# EAGLE design icu_board (EAGLE 9.3.0)
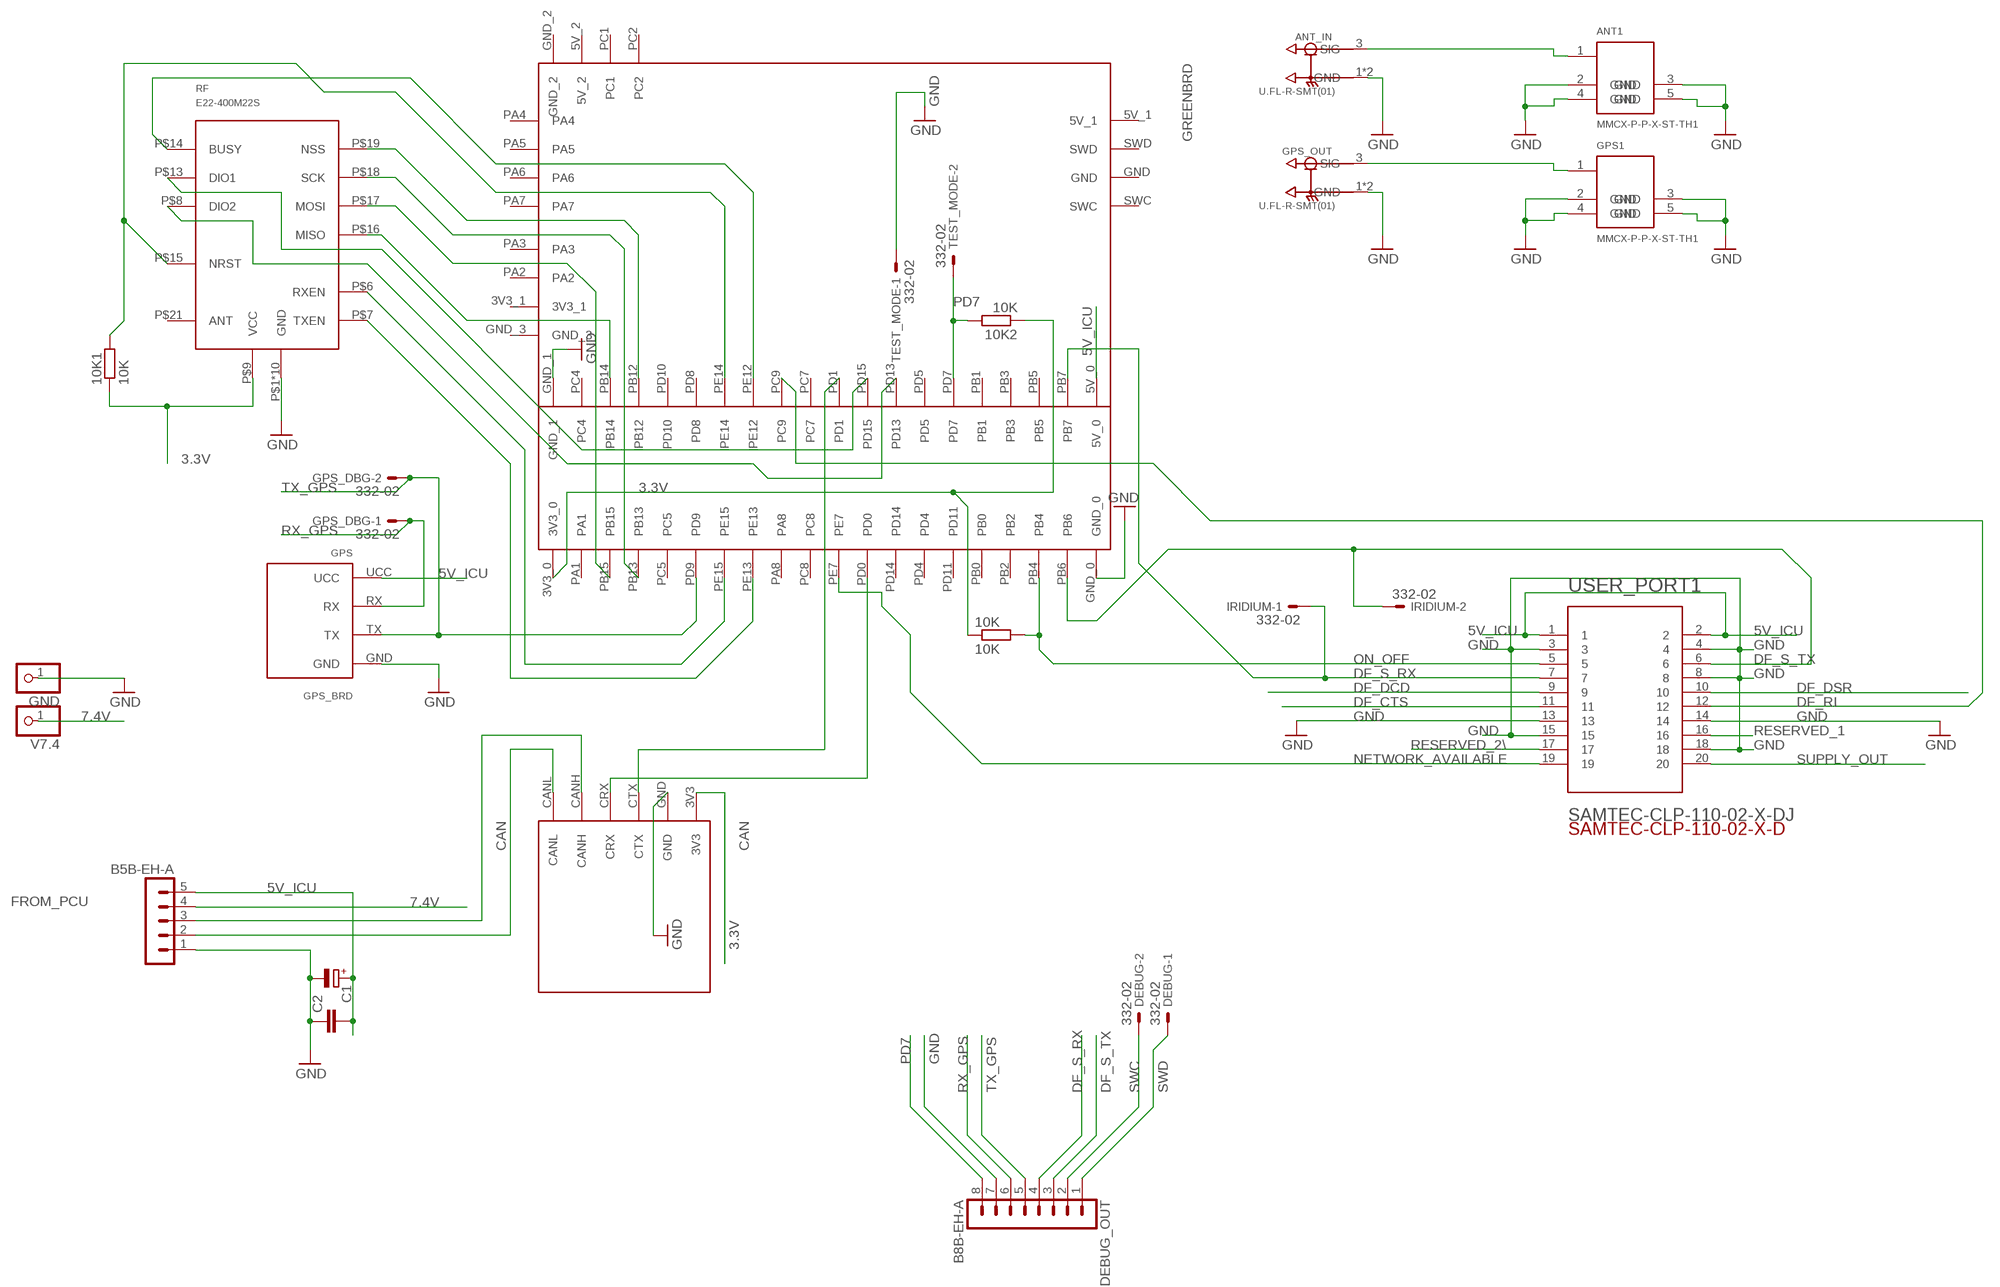
[diagram p0: schematic, sheet 1]

## Parts
10K  10K  R-EU_0204/7  [0204/7]
10K1  10K  R-EU_0204/7  [0204/7]
10K2  10K  R-EU_0204/7  [0204/7]
ANT1  MMCX-P-P-X-ST-TH1  [MMCX-P-P-X-ST-TH1]
ANT_IN  U.FL-R-SMT(01)  [HRS_U.FL-R-SMT(01)]
C1  CPOL-EUE3.5-8  [E3,5-8]
C2  C2.5/2  [C2.5-2]
CAN  CAN  [CAN]
DEBUG  332-02  [332-02]
DEBUG_OUT  B8B-EH-A  [B8B-EH-A]
FROM_PCU  B5B-EH-A  [B5B-EH-A]
GND  PINHD-1X1  [1X01]
GPS1  MMCX-P-P-X-ST-TH1  [MMCX-P-P-X-ST-TH1]
GPS_BRD  GPS  [GPS]
GPS_DBG  332-02  [332-02]
GPS_OUT  U.FL-R-SMT(01)  [HRS_U.FL-R-SMT(01)]
GREENBRD  ICU  [ICU]
IRIDIUM  332-02  [332-02]
RF  E22-400M22S  [E22-400M22S]
TEST_MODE  332-02  [332-02]
USER_PORT1  SAMTEC-CLP-110-02-X-DJ  [SAMTEC-CLP-110-02-X-D]
V7.4  PINHD-1X1  [1X01]

## Nets
3.3V: 10K1.1 10K2.1 10K.1 CAN.3V3 GREENBRD.3V3_0 RF.P$9(VCC)
5V_ICU: C1.+ C2.2 FROM_PCU.5 GPS_BRD.UCC GREENBRD.5V_0 USER_PORT1.1 USER_PORT1.2
7.4V: FROM_PCU.4 V7.4.1
DF_CTS: USER_PORT1.11
DF_DCD: USER_PORT1.9
DF_DSR: USER_PORT1.10
DF_RI: GREENBRD.PC9 USER_PORT1.12
DF_S_RX: DEBUG_OUT.4 GREENBRD.PB7 IRIDIUM.1 USER_PORT1.7
DF_S_TX: DEBUG_OUT.3 GREENBRD.PB6 IRIDIUM.2 USER_PORT1.6
GND: ANT1.2(GND) ANT1.3(GND) ANT1.4(GND) ANT1.5(GND) ANT_IN.1(GND) ANT_IN.2(GND) C1.- C2.1 CAN.GND DEBUG_OUT.7 FROM_PCU.1 GND.1 GPS1.2(GND) GPS1.3(GND) GPS1.4(GND) GPS1.5(GND) GPS_BRD.GND GPS_OUT.1(GND) GPS_OUT.2(GND) GREENBRD.GND_0 GREENBRD.GND_1 RF.P$1(GND) RF.P$2(GND) RF.P$3(GND) RF.P$4(GND) RF.P$5(GND) RF.P$10(GND) RF.P$11(GND) RF.P$12(GND) RF.P$20(GND) RF.P$22(GND) TEST_MODE.1 USER_PORT1.3 USER_PORT1.4 USER_PORT1.8 USER_PORT1.13 USER_PORT1.14 USER_PORT1.15 USER_PORT1.18
N$1: CAN.CANH FROM_PCU.3
N$2: GREENBRD.PB12 RF.P$19(NSS)
N$3: CAN.CANL FROM_PCU.2
N$4 [rf]: ANT1.1 ANT_IN.3(SIG)
N$5 [rf]: GPS1.1 GPS_OUT.3(SIG)
N$6: GREENBRD.PE15 RF.P$6(RXEN)
N$8: GREENBRD.PB13 RF.P$18(SCK)
N$9: CAN.CRX GREENBRD.PD0
N$10: CAN.CTX GREENBRD.PD1
N$12: GREENBRD.PD15 RF.P$13(DIO1)
N$13: GREENBRD.PD13 RF.P$8(DIO2)
N$15: GREENBRD.PB15 RF.P$17(MOSI)
N$16: GREENBRD.PB14 RF.P$16(MISO)
N$17: GREENBRD.PE12 RF.P$14(BUSY)
N$18: 10K1.2 GREENBRD.PE14 RF.P$15(NRST)
N$22: GREENBRD.PE13 RF.P$7(TXEN)
NETWORK_AVAILABLE: GREENBRD.PE7 USER_PORT1.19
ON_OFF: 10K.2 GREENBRD.PB4 USER_PORT1.5
PD7: 10K2.2 DEBUG_OUT.8 GREENBRD.PD7 TEST_MODE.2
RESERVED_1: USER_PORT1.16
RESERVED_2\: USER_PORT1.17
RX_GPS: DEBUG_OUT.6 GPS_BRD.RX GPS_DBG.1
SUPPLY_OUT: USER_PORT1.20
SWC: DEBUG.2 DEBUG_OUT.2
SWD: DEBUG.1 DEBUG_OUT.1
TX_GPS: DEBUG_OUT.5 GPS_BRD.TX GPS_DBG.2 GREENBRD.PD9
Unconnected: GREENBRD.3V3_1 GREENBRD.5V_1 GREENBRD.5V_2 GREENBRD.GND GREENBRD.GND_2 GREENBRD.GND_3 GREENBRD.PA1 GREENBRD.PA2 GREENBRD.PA3 GREENBRD.PA4 GREENBRD.PA5 GREENBRD.PA6 GREENBRD.PA7 GREENBRD.PA8 GREENBRD.PB0 GREENBRD.PB1 GREENBRD.PB2 GREENBRD.PB3 GREENBRD.PB5 GREENBRD.PC1 GREENBRD.PC2 GREENBRD.PC4 GREENBRD.PC5 GREENBRD.PC7 GREENBRD.PC8 GREENBRD.PD4 GREENBRD.PD5 GREENBRD.PD8 GREENBRD.PD10 GREENBRD.PD11 GREENBRD.PD14 GREENBRD.SWC GREENBRD.SWD RF.P$21(ANT)

## Library data of the parts
10K 10K1 10K2 = rcl:R-EU_: RESISTOR, European symbol; SPICEPREFIX: R
ANT1 GPS1 = MMCX-P-P-X-ST-TH1:MMCX-P-P-X-ST-TH1: MMCX STRAIGHT,THROUGH HOLE PLUG - 50 OHM.; DESCRIPTION: Conn MMCX PL 0Hz to 6GHz 50Ohm Solder ST Thru-Hole Gold Over Nickel; DIGI-KEY_PART_NUMBER: SAM10618-ND; DIGI-KEY_PURCHASE_URL: https://www.digikey.ru/product-detail/en/samtec-inc/MMCX-P-P-H-ST-TH1/SAM10618-ND/6561612?utm_source=snapeda&utm_medium=aggregator&utm_campaign=symbol; MF: Samtec Inc.; MP: MMCX-P-P-H-ST-TH1; PACKAGE: None
ANT_IN GPS_OUT = U.FL-R-SMT_01_:U.FL-R-SMT(01): U.FL Series 6 Ghz 50 Ohm Ultra-small SMT Coaxial Cable Receptacle; DESCRIPTION: U.FL Series 6 Ghz 50 Ohm Ultra-small SMT Coaxial Cable Receptacle; DIGI-KEY_PART_NUMBER: H9161-ND; DIGI-KEY_PURCHASE_URL: https://www.digikey.ru/product-detail/en/hirose-electric-co-ltd/U.FL-R-SMT_01_/H9161-ND/513010?utm_source=snapeda&utm_medium=aggregator&utm_campaign=symbol; MF: Hirose; MP: U.FL-R-SMT_01_; PACKAGE: None
C1 = rcl:CPOL-EU: POLARIZED CAPACITOR, European symbol; SPICEPREFIX: C
C2 = capacitor-wima:C: CAPACITOR naming: grid - package width
CAN = bluepill:CAN
DEBUG GPS_DBG IRIDIUM TEST_MODE = con-garry:332-02: 2 Pin - 2mm Dual Row Source: www.mpe-connector.de / garry_shortform_2012.pdf
DEBUG_OUT = con-jst-eh:B8B-EH-A: HEADER
FROM_PCU = con-jst-eh:B5B-EH-A: HEADER
GND V7.4 = pinhead:PINHD-1X1: PIN HEADER
GPS_BRD = bluepill:GPS
GREENBRD = bluepill:ICU
RF = ebyte-radio:E22-400M22S: EBYTE E22400M22S radio module Datasheet and info: http://www.ebyte.com/en/product-view-news.aspx?id=436
USER_PORT1 = SAMTEC-CLP-110-02-X-D:SAMTEC-CLP-110-02-X-D; DESCRIPTION: .050 Tiger Claw™ Rugged Reliable Dual Wipe Socket Strip; DIGI-KEY_PART_NUMBER: CLP-110-02-L-D-K-ND; DIGI-KEY_PURCHASE_URL: https://www.digikey.ru/product-detail/en/samtec-inc/CLP-110-02-L-D-K/CLP-110-02-L-D-K-ND/6693709?utm_source=snapeda&utm_medium=aggregator&utm_campaign=symbol; MF: Samtec Inc.; MP: CLP-110-02-L-D-K; PACKAGE: None

## Net classes
0 default: width 0.2 mm, clearance 0.2 mm
1 power: width 0.5 mm, clearance 0.2 mm
2 rf: width 0.5 mm, clearance 0.065 mm

## Board
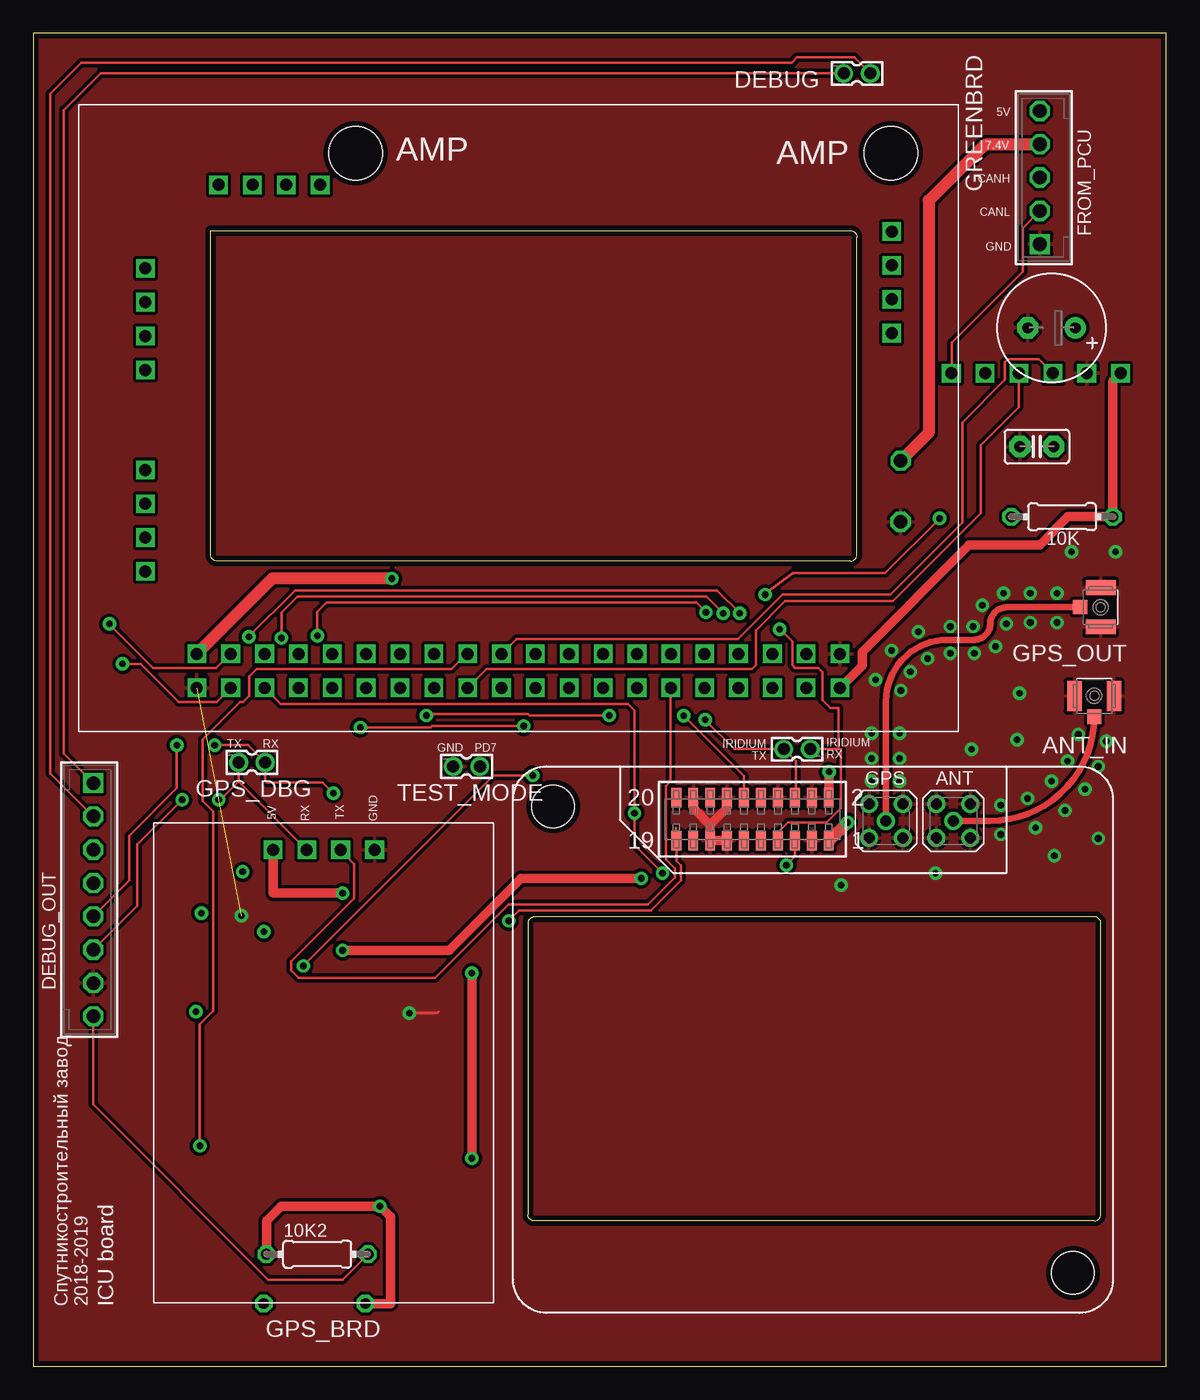
[diagram p1: board, top side]
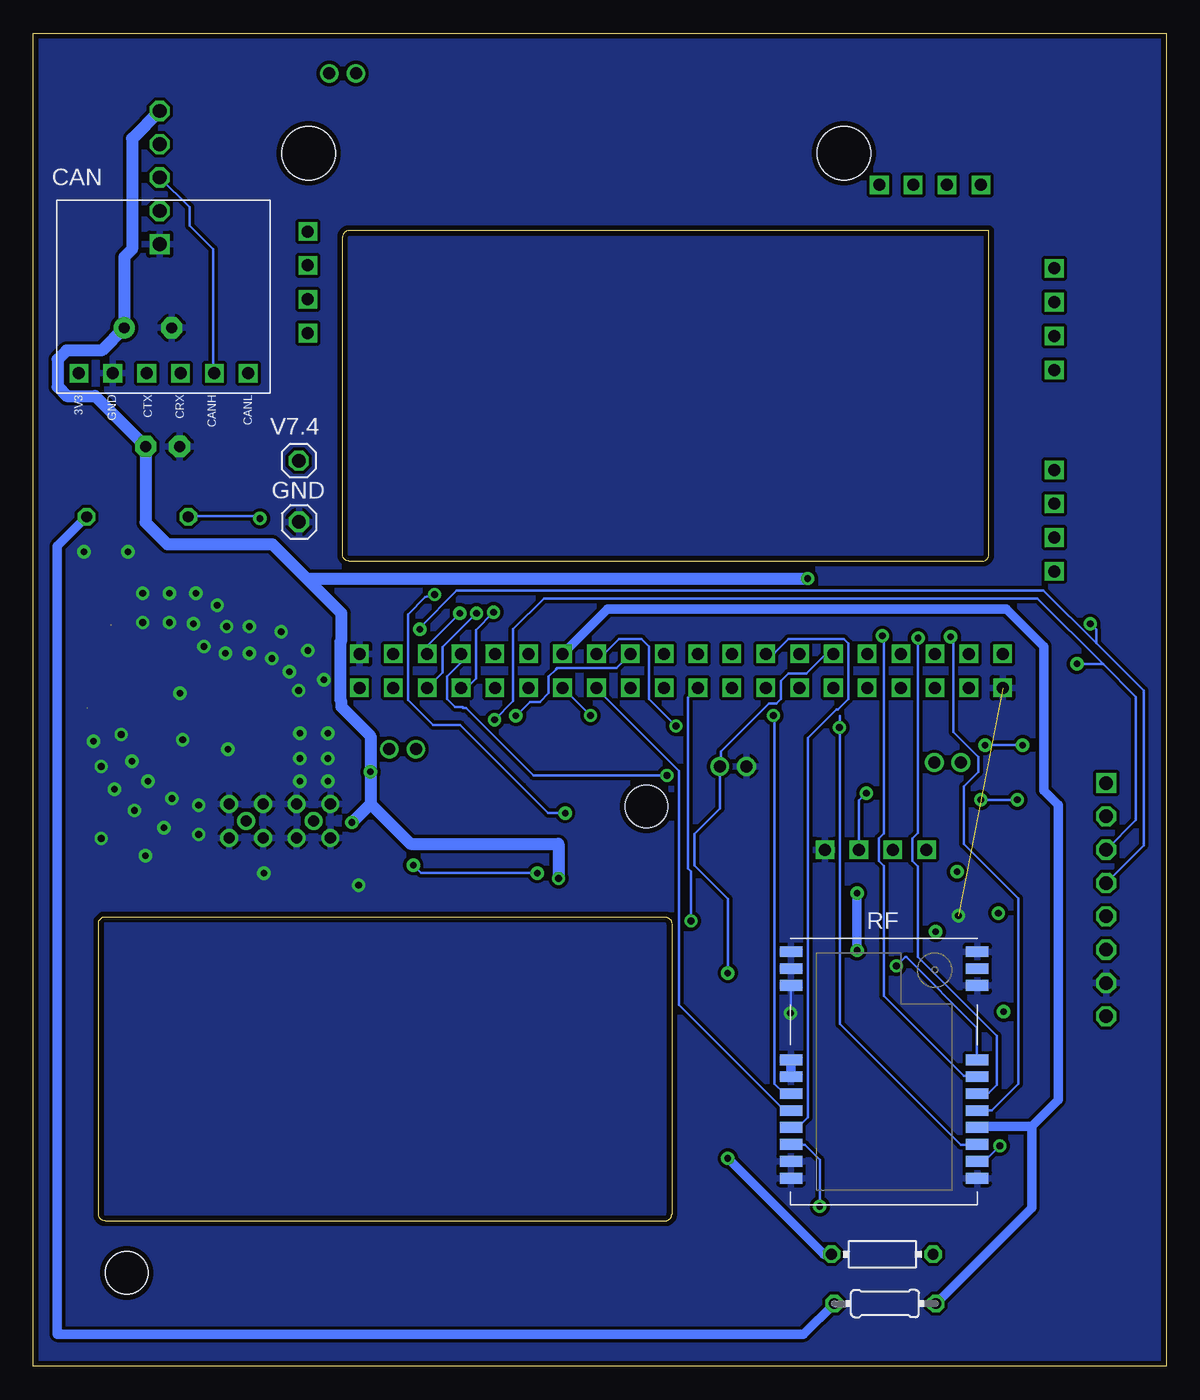
[diagram p2: board, bottom side, seen from below]

Size 85 x 100 mm. Coordinates in mm from the lower left corner, seen from the top.
Outline: 0,0 85,0 85,100 0,100 0,0
Outline: 13.3,85.2 61.3,85.2 arc-90 61.8,84.7 61.8,60.9 arc-90 61.3,60.4 13.8,60.4 arc-90 13.3,60.9 13.3,85.2
Outline: 37.1,33.2 37.1,11.4 arc90 37.6,10.9 79.6,10.9 arc90 80.1,11.4 80.1,33.4 79.8,33.7 37.6,33.7 arc90 37.1,33.2
Copper layers (1*16): Top 0.035mm / dielectric 1mm / Bottom 0.035mm
Design rules "rezonit": minimum track width 0.2mm, minimum drill 0.5mm, track to track 0.25mm, track to pad 0.25mm, pad to pad 0.25mm, via to via 0.25mm, smd to smd 0.2mm, copper to edge 0.4mm, drill to drill 0.4mm, minimum pad ring 0.25mm, minimum via ring 0.25mm, stop-mask expansion 4mil, vias tented up to drill 0.6mm, thermal gap 10mil
Holes 3.2 mm at 39,42 78,7
Holes 4 mm at 24.18,91.01 64.34,91.01

### Footprints (pad centres in the part's own frame; a part is rotated, then mirrored left to right if it is on the bottom)
0204/7 = drill 0.813 octagon: 1 -3.81,0; 2 3.81,0
MMCX-P-P-X-ST-TH1 = drill 0.84 pad 1.3: 1 0,0; 2 -1.27,1.27; 3 -1.27,-1.27; 4 1.27,1.27; 5 1.27,-1.27
HRS_U.FL-R-SMT(01) = smd 1.1 x 2.25: 1 -1.475,0; 2 1.475,0 | smd 1.05 x 1.1: 3 0,-1.55
E3,5-8 = drill 0.813 pad 1.6: + -1.778,0 | drill 0.813 pad 1.6 octagon: - 1.778,0
C2.5-2 = drill 0.813 pad 1.6 octagon: 1 -1.27,0; 2 1.27,0
CAN = drill 0.9 square: 3V3 -5.75,6.35; CANH -5.75,-3.81; CANL -5.75,-6.35; CRX -5.75,-1.27; CTX -5.75,1.27; GND -5.75,3.81
332-02 = drill 0.9 pad 1.27: 1 0,-1; 2 0,1
B8B-EH-A = drill 1.016 square: 1 -8.75,0 | drill 1.016 octagon: 2 -6.25,0; 3 -3.75,0; 4 -1.25,0; 5 1.25,0; 6 3.75,0; 7 6.25,0; 8 8.75,0
B5B-EH-A = drill 1.016 square: 1 -5,0 | drill 1.016 octagon: 2 -2.5,0; 3 0,0; 4 2.5,0; 5 5,0
1X01 = drill 1.016 octagon: 1 0,0
GPS = drill 0.9 square: GND -16,3.81; RX -16,-1.27; TX -16,1.27; UCC -16,-3.81
ICU = drill 0.9 square: 3V3_0 20.23,24.13; 3V3_1 8.96,-28; 5V_0 17.69,-24.13; 5V_1 -14,28; 5V_2 -17.5,-19.96; GND -8.92,28; GND_0 20.23,-24.13; GND_1 17.69,24.13; GND_2 -17.5,-22.5; GND_3 11.5,-28; PA1 20.23,21.59; PA2 6.42,-28; PA3 3.88,-28; PA4 -11.24,-28; PA5 -8.7,-28; PA6 -6.16,-28; PA7 -3.62,-28; PA8 20.23,3.81; PB0 20.23,-13.97; PB1 17.69,-13.97; PB2 20.23,-16.51; PB3 17.69,-16.51; PB4 20.23,-19.05; PB5 17.69,-19.05; PB6 20.23,-21.59; PB7 17.69,-21.59; PB12 17.69,16.51; PB13 20.23,16.51; PB14 17.69,19.05; PB15 20.23,19.05; PC1 -17.5,-17.42; PC2 -17.5,-14.88; PC4 17.69,21.59; PC5 20.23,13.97; PC7 17.69,1.27; PC8 20.23,1.27; PC9 17.69,3.81; PD0 20.23,-3.81; PD1 17.69,-1.27; PD4 20.23,-8.89; PD5 17.69,-8.89; PD7 17.69,-11.43; PD8 17.69,11.43; PD9 20.23,11.43; PD10 17.69,13.97; PD11 20.23,-11.43; PD13 17.69,-6.35; PD14 20.23,-6.35; PD15 17.69,-3.81; PE7 20.23,-1.27; PE12 17.69,6.35; PE13 20.23,6.35; PE14 17.69,8.89; PE15 20.23,8.89; SWC -6.38,28; SWD -11.46,28
E22-400M22S = smd 0.813 x 1.676: P$1 -9,-6.97; P$2 -7.73,-6.97; P$3 -6.46,-6.97; P$4 -0.89,-6.97; P$5 0.38,-6.97; P$6 1.65,-6.97; P$7 2.92,-6.97; P$8 4.19,-6.97; P$9 5.46,-6.97; P$10 6.73,-6.97; P$11 8,-6.97; P$12 8,7; P$13 6.73,7; P$14 5.46,7; P$15 4.19,7; P$16 2.92,7; P$17 1.65,7; P$18 0.38,7; P$19 -0.89,7; P$20 -6.46,7; P$21 -7.73,7; P$22 -9,7
SAMTEC-CLP-110-02-X-D = smd 0.74 x 1.47: 1 -5.715,1.613; 2 -5.715,-1.613; 3 -4.445,1.613; 4 -4.445,-1.613; 5 -3.175,1.613; 6 -3.175,-1.613; 7 -1.905,1.613; 8 -1.905,-1.613; 9 -0.635,1.613; 10 -0.635,-1.613; 11 0.635,1.613; 12 0.635,-1.613; 13 1.905,1.613; 14 1.905,-1.613; 15 3.175,1.613; 16 3.175,-1.613; 17 4.445,1.613; 18 4.445,-1.613; 19 5.715,1.613; 20 5.715,-1.613

### Placement (x,y rotation side)
10K  77.19,63.73 180 top
10K1  21.1,4.7 0 bottom
10K2  21.3,8.4 0 top
ANT1  69.03,40.91 0 top
ANT_IN  79.6,50.28 0 top
C1  76.4,77.9 180 top
C2  75.3,69 0 top
CAN  75.23,80.25 90 bottom
DEBUG  61.8,97 270 top
DEBUG_OUT  4.5,35 270 top
FROM_PCU  75.52,89.18 90 top
GND  65.07,63.34 0 bottom
GPS1  63.98,40.91 0 top
GPS_BRD  21.79,22.75 270 top
GPS_DBG  16.4,45.3 270 top
GPS_OUT  80.08,56.94 270 top
GREENBRD  36.4,71.13 270 top
IRIDIUM  57.3,46.3 90 top
RF  21.18,22.1 270 bottom
TEST_MODE  32.5,45 270 top
USER_PORT1  53.96,41.05 180 top
V7.4  65.09,67.94 0 bottom

### Tracks (layer width: path | path; a pad name or v marks a point on that pad's centre or on a via)
3.3V  (via drill 0.5)
  Top 0.7: 10K1.1 26.8,4.7 26.8,11.2 v26,12 18.6,12 17.49,10.89 10K2.1 | CAN.3V3 81,73.92 10K.1 77.63,63.73 75.5,61.6 70.2,61.6 62.2,53.6 62.2,52.57 GREENBRD.3V3_0
  Bottom 0.2: v26,12 26,15.5 27.1,16.6 28.1,16.6 RF.P$9
  Bottom 0.7: 10K.1 83.2,61.53 83.2,2.4 27.21,2.4 10K1.1
5V_ICU  (via drill 0.5)
  Top 0.2: 59.7,42.7 USER_PORT1.2 | 18,38.7 GPS_BRD.UCC
  Top 0.7: v59.7,44.6 59.7,42.7 | v23.2,35.5 18,35.5 18,38.7 | v45.6,36.6 36.6,36.6 31.2,31.2 v23.2,31.2 | 61,40.7 v61.1,40.8 | 59.74,39.44 USER_PORT1.1
  Top 0.9: v61.1,40.8 59.74,39.44 | v26.9,59.1 17.93,59.1 GREENBRD.5V_0
  Bottom 0.7: v23.2,31.2 v23.2,35.5
  Bottom 0.9: FROM_PCU.5 77.6,92.1 77.6,83.8 78.18,83.22 C1.+ 79.87,76.2 82.5,76.2 83.18,75.52 83.18,73.48 82.5,72.8 80.37,72.8 C2.2 76.57,63.3 74.95,61.68 67.08,61.68 64.5,59.1 | v45.6,36.6 45.6,39.2 56.7,39.2 59.7,42.2 | 59.7,42.2 v59.7,44.6 59.7,47.28 61.88,49.46 61.88,49.86 61.93,49.91 61.93,54.43 61.88,54.48 61.88,56.48 64.5,59.1 | 59.7,42.2 v61.1,40.8 | 64.5,59.1 v26.9,59.1
7.4V
  Top 0.9: V7.4.1 67.18,70.03 67.18,87.45 67.21,87.45 71.3,91.53 arc-45 71.65,91.68 FROM_PCU.4
DF_RI  (via drill 0.5)
  Top 0.2: USER_PORT1.12 53.3,42.7 53.3,44.3 v48.8,48.8
  Bottom 0.2: v48.8,48.8 47.75,49.85 46.98,49.85 46.34,50.49 46.34,51.74 45.8,52.28 | 45.8,52.28 45.8,52.3 | 45.8,52.28 45.7,52.39 41.26,52.39 GREENBRD.PC9
DF_S_RX  (via drill 0.5)
  Top 0.2: 60.4,46.3 60.4,49.4 59.8,49.4 59.2,50 59.2,52.1 58.91,52.39 57.15,52.39 56.94,52.59 56.94,54.36 v56,55.3 | USER_PORT1.7 55.9,39.5 55.9,40.1 56.6,40.8 59.5,40.8 60.6,41.9 60.6,46.3 60.4,46.3 | IRIDIUM.1 60.4,46.3 | v5.7,55.7 9.01,52.39 13.12,52.39 13.12,52.4 13.7,52.4 14.74,53.44 GREENBRD.PB7
  Bottom 0.2: 5.25,54.25 9.21,58.2 53.23,58.2 56,55.43 v56,55.3 | 5.25,54.25 1.68,50.68 1.68,39.07 DEBUG_OUT.4 | 5.25,54.25 5.25,55.25 v5.7,55.7
DF_S_TX  (via drill 0.5)
  Top 0.2: USER_PORT1.6 57.2,42.7 57.2,45.4 IRIDIUM.2 52.6,46.3 v50.4,48.5 | v6.7,52.7 8.06,52.7 10.91,49.85 13.76,49.85 GREENBRD.PB6
  Bottom 0.2: v50.4,48.5 49,49.9 49,55.3 46.7,57.6 9.67,57.6 4.74,52.66 | 4.74,52.66 2.28,50.21 2.28,40.97 DEBUG_OUT.3 | 4.74,52.66 6.67,52.66 v6.7,52.7
GND  (via drill 0.5)  (1 unrouted)
  Top 0.2: USER_PORT1.15 | v28.2,26.5 30.3,26.5 30.4,26.6
  Top 0.7: USER_PORT1.15 USER_PORT1.13 | USER_PORT1.18 49.52,41.88 50.78,40.62 | 50.78,40.62 USER_PORT1.15 | USER_PORT1.14 52.05,41.89 50.78,40.62
  Bottom 0.2: RF.P$3 28.15,26.55 v28.2,26.5
  Bottom 0.7: RF.P$4 RF.P$5
  other vias: 67.1,53.1 74.8,58 74.8,55.8 70.5,55.5 70.6,53.5 71.2,57.1 68.8,53.5 64.4,53.7 66.4,55.1 65.1,50.7 63.2,51.5 65.8,52.1 68.8,55.5 72.2,54 80.5,46.9 78.4,47.4 76.8,55.8 72.8,58 73,55.7 76.8,58 81.2,61.1 15.6,33.8 62.9,47.5 65,47.5 65,45.6 62.9,45.6 62.9,43.9 65,43.9 79.9,45 77.6,45.4 78.9,43.3 76.4,43.9 77.4,41.7 74.6,42.6 72.6,42.1 72.6,39.9 75.2,40.4 74,50.5 70.4,46.3 73.8,47 77.9,61.1 67.7,37 76.6,38.3 79.9,39.6 60.6,36.1
  pour Top: 0,100 85,100 85,0 0,0
  pour Bottom: 0,100 85,100 85,0 0,0
N$1
  Bottom 0.2: CAN.CANH 71.5,74.5 71.5,83.8 73.29,85.59 73.29,86.95 FROM_PCU.3
N$2  (via drill 0.5)
  Top 0.2: v37.46,44.33 34.54,44.33 v20.25,30.04
  Bottom 0.2: RF.P$19 14.2,23 14.2,25.4 19.5,30.7 19.57,30.71 v20.25,30.04 | GREENBRD.PB12 52.91,52.8 53.96,51.74 53.96,50.05 53.35,49.45 52.8,49.45 52.76,49.39 52.54,49.39 47.48,44.33 v37.46,44.33
N$3
  Top 0.2: CAN.CANL 68.9,74.5 68.9,76.8 74.23,82.13 74.23,85.39 FROM_PCU.2
N$4
  Top 0.5: ANT1.1 71.78,40.91 arc90 ANT_IN.3
N$5
  Top 0.5: GPS1.1 63.98,49.88 arc-90 68.6,54.5 70.6,54.5 arc90 71.8,55.7 arc-90 73.04,56.94 GPS_OUT.3
N$6  (via drill 0.5)
  Top 0.2: v43.2,48.83 37.24,48.83 37.12,48.94 29.59,48.94 v29.48,48.83
  Bottom 0.2: 29.4,49.1 29.4,48.83 | 29.4,48.83 29.4,21.2 28.7,20.5 28.2,20.5 RF.P$6 | v43.2,48.83 45.23,50.85 GREENBRD.PE15 | v29.48,48.83 29.4,48.83
N$8  (via drill 0.5)
  Top 0.2: v21.3,54.8 21.3,56.6 22,57.3 49.75,57.3 v50.47,56.57
  Bottom 0.2: RF.P$18 14.2,21.8 15.2,21.8 21.2,27.8 21.2,37.53 21.57,37.91 21.57,39.59 21.2,39.97 21.2,54.7 v21.3,54.8 | v50.47,56.57 51.8,55.25 51.8,51.6 52.5,50.9 GREENBRD.PB13
N$9
  Top 0.2: GREENBRD.PD0 33.99,52.3 53.9,52.3 54.2,52.6 54.2,55.2 56.4,57.4 64.5,57.4 71.1,64 71.1,69.1 73.96,71.96 CAN.CRX
N$10
  Top 0.2: GREENBRD.PD1 36.26,54.57 52.87,54.57 56.2,57.9 64.3,57.9 69.7,63.3 69.7,70.8 72.91,74.01 72.91,75.34 73.11,75.55 75.45,75.55 CAN.CTX
N$12  (via drill 0.5)
  Top 0.2: v12.49,16.54 12.49,25.65 13.5,26.66 13.5,41.62 12.71,42.41 12.71,47.02 15.53,49.84 15.75,49.84 16.2,50.29 16.2,51.75 16.76,52.31 31.39,52.31 32.51,53.44 GREENBRD.PD15
  Bottom 0.2: 14.21,15.4 RF.P$13 14.18,15.41 13.61,15.41 v12.49,16.54
N$13
  Bottom 0.2: 28.2,18 RF.P$8 28.12,18 27.56,18 26.89,18.68 26.89,47.14 24.75,49.27 24.64,49.27 23.85,50.06 23.85,54.23 24.19,54.56 28.35,54.56 29.36,53.55 30.04,53.55 GREENBRD.PD13
N$14  (via drill 0.5)
  other vias: 17.3,32.6
N$15  (via drill 0.5)
  Top 0.2: v18.62,54.63 18.62,56.53 19.84,57.75 50.5,57.75 v51.75,56.5
  Bottom 0.2: RF.P$17 14.1,20.5 13.3,20.5 12.7,21.1 12.7,24.8 18.62,30.72 18.62,37.49 19.03,37.91 19.03,39.59 18.62,40.01 v18.62,54.63 | v51.75,56.5 54.3,53.95 54.3,52.05 GREENBRD.PB15
N$16  (via drill 0.5)
  Top 0.2: v16.18,54.73 19.65,58.2 51.3,58.2 v53,56.5
  Bottom 0.2: RF.P$16 14.1,19.2 13.1,19.2 11.1,21.2 11.1,35.1 15.2,39.2 15.2,43.48 14.1,44.58 14.1,45.72 15.96,47.58 15.96,54.52 v16.18,54.73 | v53,56.5 55.45,54.05 GREENBRD.PB14
N$17  (via drill 0.5)
  Top 0.2: v36.79,48.04 29.93,48.04 29.81,47.92 v24.52,47.92
  Bottom 0.2: RF.P$14 14.22,16.6 15.4,16.6 24.5,25.7 24.5,47.92 | 24.5,48.8 24.5,47.92 | v36.79,48.04 38.81,50.06 38.81,54 39.38,54.56 41.06,54.56 42.08,53.55 42.75,53.55 GREENBRD.PE12 | v24.52,47.92 24.5,47.92
N$18
  Bottom 0.2: RF.P$15
  Bottom 0.7: RF.P$15 14.08,18 10.1,18 | 10.1,18 8.1,20 8.1,42.1 9.2,43.2 9.2,54 12,56.8 41.93,56.8 GREENBRD.PE14 | 10.1,18 10.1,11.89 10K1.2
N$19  (via drill 0.5)
  other vias: 12.6,34
N$20  (via drill 0.5)
  other vias: 15.7,37.1
N$21  (via drill 0.5)
  other vias: 12.2,26.6
N$22
  Bottom 0.2: 28.2,19.2 RF.P$7 28.24,19.24 28.69,19.24 36.56,27.11 36.56,44.66 42.75,50.85 GREENBRD.PE13
NETWORK_AVAILABLE  (via drill 0.5)
  Top 0.2: 48.2,40.4 48.2,39.5 USER_PORT1.19 48.26,39.38 48.26,37.91 48.6,37.58 48.6,36.45 46.35,34.2 36.45,34.2 v35.66,33.41
  Bottom 0.2: v35.66,33.41 35.66,37.12 35.89,37.35 35.89,50.17 35.21,50.85 GREENBRD.PE7
ON_OFF  (via drill 0.5)
  Top 0.2: USER_PORT1.5 57.13,38.23 v56.5,37.6 | v47.2,37 45.1,39.1 v45.1,41.5 45.1,49.2 44.6,49.7 18.55,49.7 GREENBRD.PB4 | v54.9,57.9 54.8,57.9 57,59.5 63.9,59.5 v68,63.6
  Bottom 0.2: v56.5,37.6 55.9,37 v47.2,37 | v45.1,41.5 46.4,41.5 53,48.1 55,48.1 56.9,50 56.9,56.4 55.6,57.7 v54.9,57.9 | 10K.2 73.33,63.78 68.18,63.78 v68,63.6
PD7  (via drill 0.5)
  Top 0.2: 10K2.2 23.21,6.5 17.63,6.5 4.5,19.63 DEBUG_OUT.8
  Top 0.7: v32.9,15.6 v32.9,29.5
  Bottom 0.2: v32.9,29.5 32.9,35.06 35.41,37.56 35.41,39.94 33.5,41.84 TEST_MODE.2 33.41,45 33.41,46.12 29.81,49.73 29.25,49.73 28.91,50.06 28.91,51.41 28.35,51.98 27,51.98 25.54,53.44 GREENBRD.PD7
  Bottom 0.7: 10K2.2 25.7,8.4 v32.9,15.6
RX_GPS  (via drill 0.5)
  Top 0.2: GPS_BRD.RX 15.4,43.87 | 15.4,43.87 GPS_DBG.1 | 15.4,43.87 14.33,42.8 v13.9,42.5 | v11.17,42.5 7.8,39.13 7.8,34.55 DEBUG_OUT.6
  Bottom 0.2: v13.9,42.5 v11.17,42.5
SWC
  Top 0.2: DEBUG.2 61.6,98.2 57.3,98.2 56.9,97.8 3.6,97.8 1.28,95.48 1.28,44.47 DEBUG_OUT.2
SWD
  Top 0.2: DEBUG.1 5.07,97 2.28,94.21 2.28,45.97 DEBUG_OUT.1
TX_GPS  (via drill 0.5)
  Top 0.2: 23.1,38.8 GPS_BRD.TX 23.06,38.7 24.07,37.69 24.07,35.1 19.35,30.38 19.35,29.7 19.91,29.14 30.15,29.14 35.66,34.65 46.12,34.65 48.15,36.67 48.15,37.35 47.48,38.02 47.48,43.54 47.81,43.88 47.81,50.85 GREENBRD.PD9 | v22.5,43 21.7,43.8 17.5,43.8 17.4,43.9 GPS_DBG.2 16.1,46.6 v13.6,46.6 | v10.77,46.6 10.77,43.37 7.2,39.8 7.2,36.45 DEBUG_OUT.5
  Bottom 0.2: GPS_BRD.TX 23.06,42.44 v22.5,43 | v13.6,46.6 v10.77,46.6

### Text on the board
tPlace: 5V | AMP | 7.4V | AMP | CANH | CANL | GND | 10K | IRIDIUM / TX | TX | RX | GND | PD7 | IRIDIUM / RX | GPS | ANT | 5V | RX | TX | GND | Спутникостроительный завод / 2018-2019 | ICU board
bPlace: CANL | CANH | CRX | CTX | GND | 3V3